# EAGLE design Adafruit NeoPixel Ring 16 rev C (EAGLE 9.6.2)
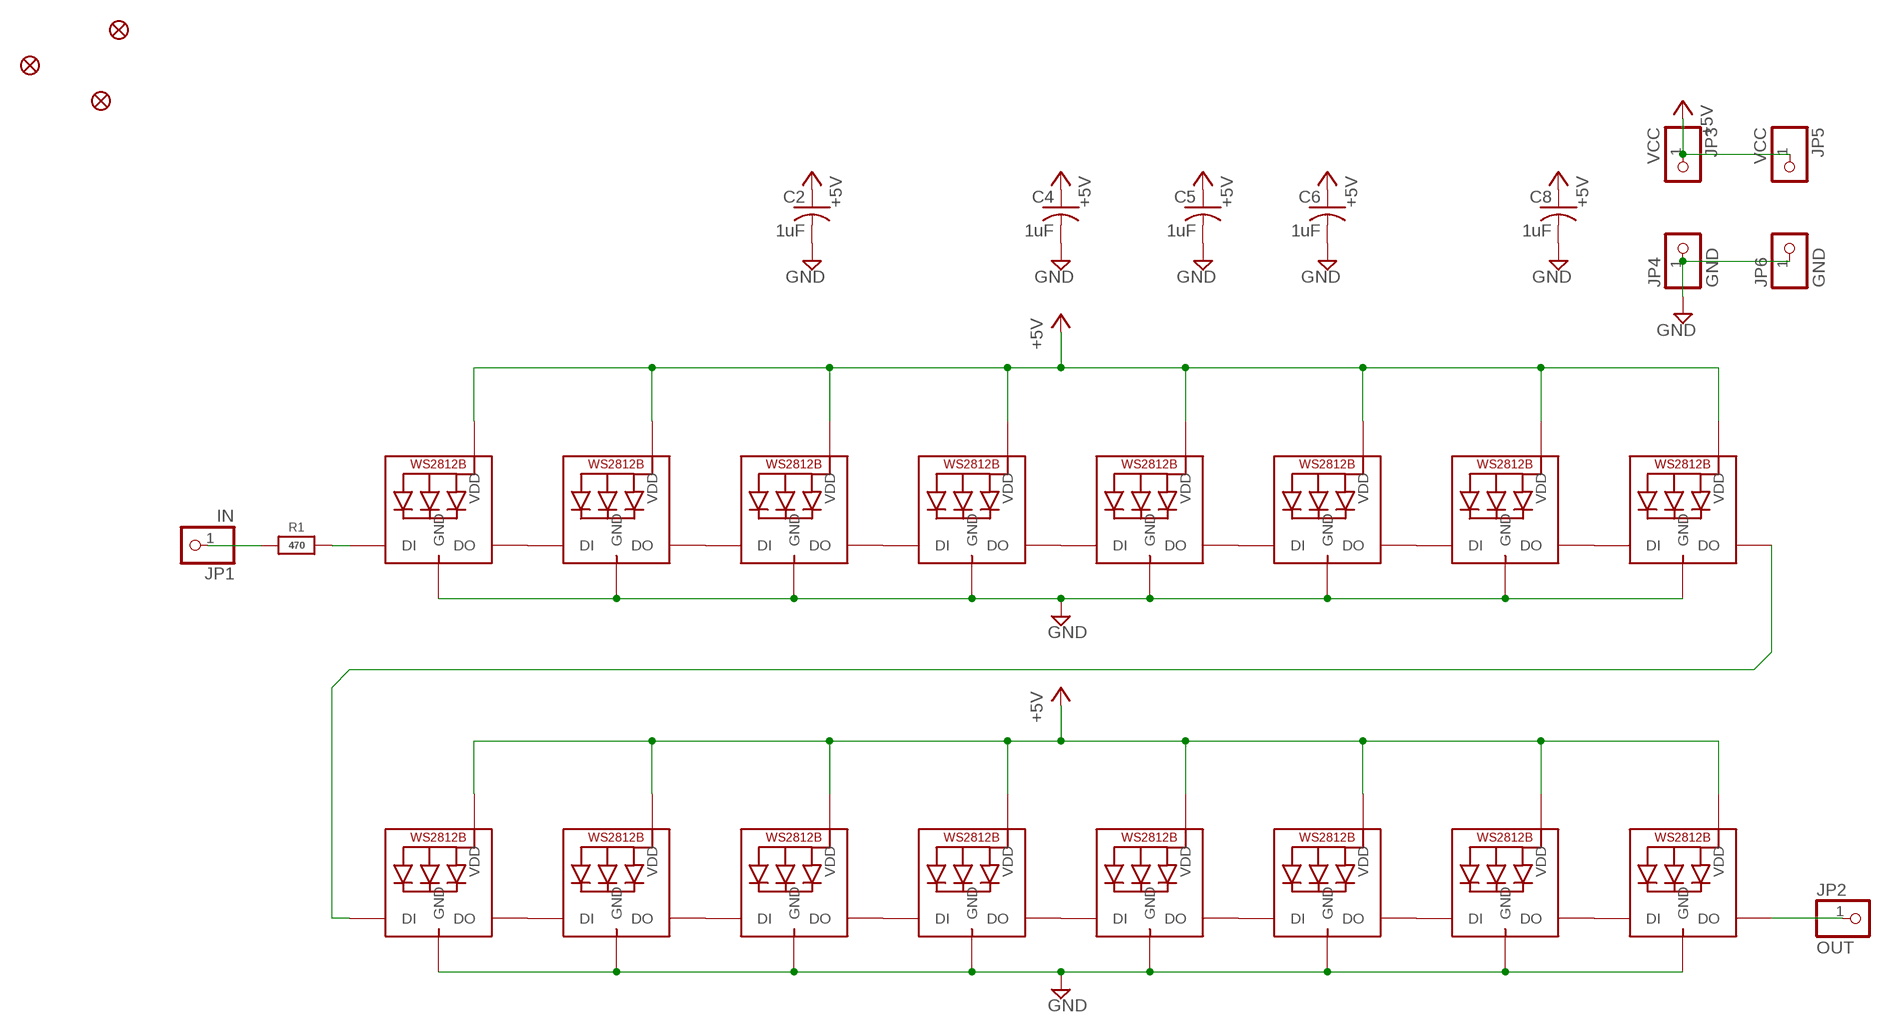
[diagram p0: schematic, sheet 1]

## Parts
C2  1uF  C-USC0603K  [C0603K]
C4  1uF  C-USC0603K  [C0603K]
C5  1uF  C-USC0603K  [C0603K]
C6  1uF  C-USC0603K  [C0603K]
C8  1uF  C-USC0603K  [C0603K]
FID1  FIDUCIAL_1MM  [FIDUCIAL_1MM]
FID2  FIDUCIAL_1MM  [FIDUCIAL_1MM]
FID3  FIDUCIAL_1MM  [FIDUCIAL_1MM]
JP1  IN  PINHD-1X1CB  [1X01-CLEANBIG]
JP2  OUT  PINHD-1X1CB  [1X01-CLEANBIG]
JP3  VCC  PINHD-1X1CB  [1X01-CLEANBIG]
JP4  GND  PINHD-1X1CB  [1X01-CLEANBIG]
JP5  VCC  PINHD-1X1CB  [1X01-CLEANBIG]
JP6  GND  PINHD-1X1CB  [1X01-CLEANBIG]
LED1  WS2812B_5050N  [WS2812B-NARROW]
LED2  WS2812B_5050N  [WS2812B-NARROW]
LED3  WS2812B_5050N  [WS2812B-NARROW]
LED4  WS2812B_5050N  [WS2812B-NARROW]
LED5  WS2812B_5050N  [WS2812B-NARROW]
LED6  WS2812B_5050N  [WS2812B-NARROW]
LED7  WS2812B_5050N  [WS2812B-NARROW]
LED8  WS2812B_5050N  [WS2812B-NARROW]
LED9  WS2812B_5050N  [WS2812B-NARROW]
LED10  WS2812B_5050N  [WS2812B-NARROW]
LED11  WS2812B_5050N  [WS2812B-NARROW]
LED12  WS2812B_5050N  [WS2812B-NARROW]
LED13  WS2812B_5050N  [WS2812B-NARROW]
LED14  WS2812B_5050N  [WS2812B-NARROW]
LED15  WS2812B_5050N  [WS2812B-NARROW]
LED16  WS2812B_5050N  [WS2812B-NARROW]
R1  470  RESISTOR_0603_NOOUT  [0603-NO]

## Nets
+5V: C2.1 C4.1 C5.1 C6.1 C8.1 JP3.1 JP5.1 LED1.1-VDD(VDD) LED2.1-VDD(VDD) LED3.1-VDD(VDD) LED4.1-VDD(VDD) LED5.1-VDD(VDD) LED6.1-VDD(VDD) LED7.1-VDD(VDD) LED8.1-VDD(VDD) LED9.1-VDD(VDD) LED10.1-VDD(VDD) LED11.1-VDD(VDD) LED12.1-VDD(VDD) LED13.1-VDD(VDD) LED14.1-VDD(VDD) LED15.1-VDD(VDD) LED16.1-VDD(VDD)
GND: C2.2 C4.2 C5.2 C6.2 C8.2 JP4.1 JP6.1 LED1.3-GND(GND) LED2.3-GND(GND) LED3.3-GND(GND) LED4.3-GND(GND) LED5.3-GND(GND) LED6.3-GND(GND) LED7.3-GND(GND) LED8.3-GND(GND) LED9.3-GND(GND) LED10.3-GND(GND) LED11.3-GND(GND) LED12.3-GND(GND) LED13.3-GND(GND) LED14.3-GND(GND) LED15.3-GND(GND) LED16.3-GND(GND)
IN: JP1.1 R1.1
N$1: LED1.2-DOUT(DO) LED2.4-DIN(DI)
N$2: LED2.2-DOUT(DO) LED3.4-DIN(DI)
N$3: LED3.2-DOUT(DO) LED4.4-DIN(DI)
N$4: LED4.2-DOUT(DO) LED5.4-DIN(DI)
N$5: LED5.2-DOUT(DO) LED6.4-DIN(DI)
N$6: LED6.2-DOUT(DO) LED7.4-DIN(DI)
N$7: LED7.2-DOUT(DO) LED8.4-DIN(DI)
N$8: LED1.4-DIN(DI) R1.2
N$9: LED9.2-DOUT(DO) LED10.4-DIN(DI)
N$10: LED10.2-DOUT(DO) LED11.4-DIN(DI)
N$11: LED11.2-DOUT(DO) LED12.4-DIN(DI)
N$12: LED12.2-DOUT(DO) LED13.4-DIN(DI)
N$13: LED13.2-DOUT(DO) LED14.4-DIN(DI)
N$14: LED14.2-DOUT(DO) LED15.4-DIN(DI)
N$15: LED15.2-DOUT(DO) LED16.4-DIN(DI)
N$16: LED8.2-DOUT(DO) LED9.4-DIN(DI)
OUT: JP2.1 LED16.2-DOUT(DO)

## Library data of the parts
C2 C4-C6 C8 = rcl:C-US: CAPACITOR, American symbol; SPICEPREFIX: C
FID1-FID3 = microbuilder:FIDUCIAL: Fiducial Alignment Points Various fiducial points for machine vision alignment.; BOM: EXCLUDE
JP1-JP6 = adafruit:PINHD-1X1: Pin header 1x1 for 0.1" spacing With round pins
LED1-LED16 = microbuilder:WS2812B
R1 = microbuilder:RESISTOR: Resistors For new designs, use the packages preceded by an '_' character since they are more reliable: The following footprints should be used on most boards: _0402 - Standard footprint for regular board layouts _0603 - Standard footprint for regular board layouts _0805 - Standard footprint for regular board layouts _1206 - Standard footprint for regular board layouts For extremely tight-pitch boards where space is at a premium, the following 'micro-pitch' footprints can be used (smaller pads, no silkscreen outline, etc.): _0402MP - Micro-pitch footprint for very dense/compact boards _0603MP - Micro-pitch footprint for very dense/compact boards _0805MP - Micro-pitch footprint for very dense/compact boards _1206MP - Micro-pitch footprint for very dense/compact boards

## Board
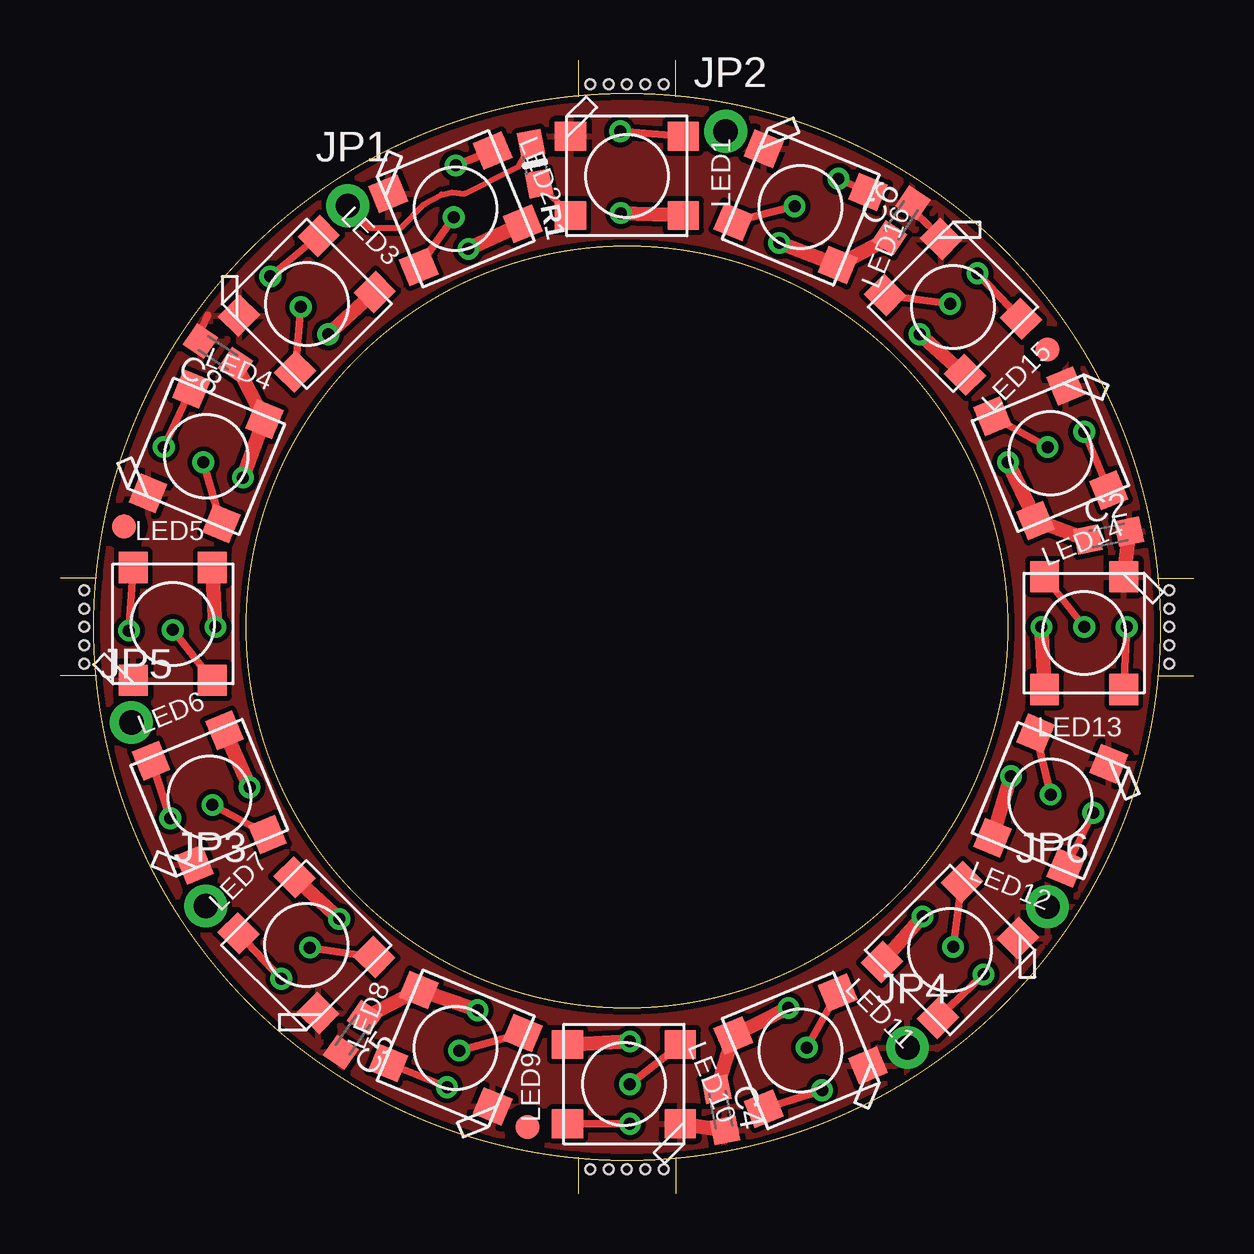
[diagram p1: board, top side]
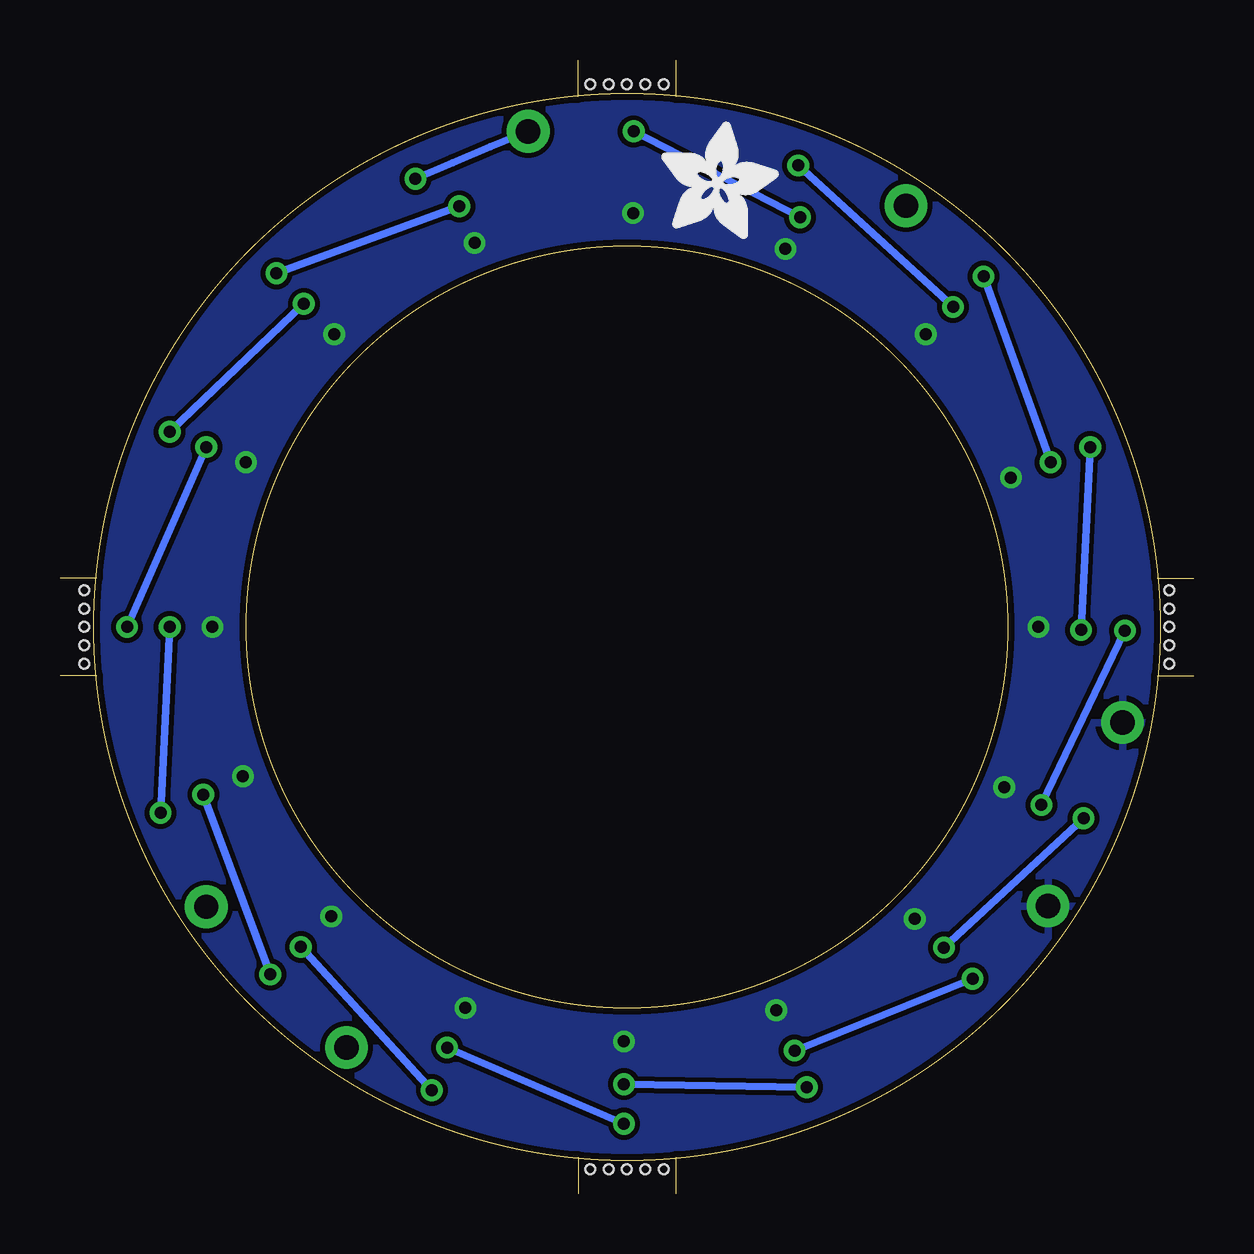
[diagram p2: board, bottom side, seen from below]

Size 47.24 x 47.24 mm. Coordinates in mm from the lower left corner, seen from the top.
Outline: 21.59,1.52 21.59,0
Outline: 25.65,1.52 25.65,0
Outline: 45.72,25.65 47.24,25.65
Outline: 45.72,21.59 47.24,21.59
Outline: 25.65,45.72 25.65,47.24
Outline: 21.59,47.24 21.59,45.72
Outline: 1.52,21.59 0,21.59
Outline: 1.52,25.65 0,25.65
Outline: circle at 23.62,23.62 radius 22.23
Outline: circle at 23.62,23.62 radius 15.88
Copper layers (1*16): Top 0.035mm / dielectric 1.5mm / Bottom 0.035mm
Design rules "adafruit *": minimum track width 8mil, minimum drill 15.5mil, track to track 8mil, track to pad 8mil, pad to pad 8mil, via to via 8mil, smd to smd 8mil, copper to edge 10mil, drill to drill 8mil, minimum pad ring 10mil, minimum via ring 8mil, stop-mask expansion 4mil, vias tented up to drill 20mil, thermal gap 10mil
Holes 0.4 mm at 23.62,46.23 22.86,46.23 22.1,46.23 24.38,46.23 25.15,46.23 1.02,23.62 1.02,24.38 1.02,22.86 1.02,22.1 1.02,25.15 46.23,23.62 46.23,24.38 46.23,25.15 46.23,22.86 46.23,22.1 23.62,1.02 22.86,1.02 22.1,1.02 24.38,1.02 25.15,1.02

### Footprints (pad centres in the part's own frame; a part is rotated, then mirrored left to right if it is on the bottom)
C0603K = smd 1.05 x 1.08: 1 -0.875,0; 2 0.875,0
FIDUCIAL_1MM = smd 1 x 1: 1 0,0
1X01-CLEANBIG = drill 1.016 pad 1.778: 1 0,0
WS2812B-NARROW = smd 1.3 x 1.2: 1-VDD 2.35,-1.65; 2-DOUT 2.35,1.65; 3-GND -2.35,1.65; 4-DIN -2.35,-1.65
0603-NO = smd 1.075 x 1: 1 -0.85,0; 2 0.85,0

### Placement (x,y rotation side)
C2  43.69,27.43 11.3 top
C4  27.53,3.51 281.3 top
C5  12.2,6.62 235.3 top
C6  35.05,40.57 56.3 top
C8  6.59,35.05 146.3 top
FID1  41.15,35.18 0 top
FID2  19.48,2.79 0 top
FID3  2.67,27.81 0 top
JP1  11.99,41.17 0 top
JP2  27.74,44.27 0 top
JP3  6.07,11.99 0 top
JP4  35.31,6.1 0 top
JP5  2.97,19.63 0 top
JP6  41.15,11.96 0 top
LED1  23.62,42.42 0 top
LED2  16.48,41.05 22.5 top
LED3  10.29,37.08 45 top
LED4  6.1,30.73 67.5 top
LED5  4.7,23.75 90 top
LED6  6.22,16.51 112.5 top
LED7  10.26,10.36 135 top
LED8  16.48,6.07 157.5 top
LED9  23.5,4.57 180 top
LED10  30.86,5.97 202.5 top
LED11  37.08,10.16 225 top
LED12  41.27,16.38 247.5 top
LED13  42.67,23.37 270 top
LED14  41.27,30.86 292.5 top
LED15  37.21,36.96 315 top
LED16  30.86,41.12 337.5 top
PLABEL0  [PLABEL0]  13.77,39.42 123.8 top
PLABEL1  [PLABEL1]  27.48,41.4 78.7 top
PLABEL2  [PLABEL2]  7.26,12.23 33.7 top
PLABEL3  [PLABEL3]  34.92,7.24 123.8 top
PLABEL4  [PLABEL4]  40.44,12.75 123.8 top
PLABEL5  [PLABEL5]  4.54,19.26 33.7 top
PLABEL6  [PLABEL6]  8.33,10.62 60 bottom
PLABEL7  [PLABEL7]  10.01,11.81 60 bottom
PLABEL8  [PLABEL8]  40.08,10.72 330 bottom
PLABEL9  [PLABEL9]  39.14,14.1 330 bottom
PLABEL10  [PLABEL10]  13.51,38.84 330 bottom
PLABEL11  [PLABEL11]  26.9,41.66 20 bottom
PLABEL12  [PLABEL12]  14.2,9.25 0 bottom
PLABEL13  [PLABEL13]  16.54,7.11 0 bottom
PLABEL14  [PLABEL14]  39.01,34.8 0 bottom
PLABEL15  [PLABEL15]  36.09,37.97 0 bottom
R1  19.79,42.93 281.3 top
U$2  [ADAFRUIT_5MM]  22.17,39.8 0 bottom

### Tracks (layer width: path | path; a pad name or v marks a point on that pad's centre or on a via)
+5V  (via drill 0.5)
  Top 0.61: v6.48,23.62 LED5.1-VDD | v7.62,29.84 LED4.1-VDD C8.1 | v11.18,35.81 LED3.1-VDD | v17.02,39.37 LED2.1-VDD | v23.37,40.87 LED1.1-VDD | v29.97,39.62 LED16.1-VDD C6.1 | LED15.1-VDD v35.81,35.81 | v39.5,30.48 LED14.1-VDD C2.1 | v40.89,23.62 LED13.1-VDD | LED12.1-VDD v39.62,17.4 | v35.94,11.56 LED11.1-VDD | v30.35,7.75 LED10.1-VDD C4.1 | LED9.1-VDD v23.75,6.35 | C5.1 LED8.1-VDD v17.4,7.64 | v11.63,11.46 LED7.1-VDD | v7.9,16.94 LED6.1-VDD
  pour Bottom: 46.48,23.62 arc90 23.62,46.48 arc90 0.76,23.62 arc90 23.62,0.76 arc90
GND
  Top 0.305: 5.84,35.92 6.15,36.6 | 35.66,40.87 36.17,40.36
  Top 0.61: C2.2 LED13.3-GND | C4.2 LED9.3-GND
  pour Top: 46.48,23.62 arc90 23.62,46.48 arc90 0.76,23.62 arc90 23.62,0.76 arc90
IN
  Top 0.254: JP1.1 11.99,41.15 12.88,40.26 14.2,40.26 15.16,41.22 15.9,41.63 16.33,41.73 16.87,41.68 19.1,42.8 R1.1
N$1  (via drill 0.5)
  Top 0.305: LED2.4-DIN v16.41,40.69 | v23.34,44.27 LED1.2-DOUT
  Bottom 0.305: v16.41,40.69 v23.34,44.27
N$2  (via drill 0.5)
  Top 0.305: LED3.4-DIN v10.03,36.96 | v16.48,42.85 LED2.2-DOUT
  Bottom 0.305: v10.03,36.96 v16.48,42.85
N$3  (via drill 0.5)
  Top 0.305: LED4.4-DIN v5.97,30.48 | v8.76,38.23 LED3.2-DOUT
  Bottom 0.305: v5.97,30.48 v8.76,38.23
N$4  (via drill 0.5)
  Top 0.305: v4.7,23.5 LED5.4-DIN | v4.32,31.12 LED4.2-DOUT
  Bottom 0.305: v4.7,23.5 v4.32,31.12
N$5  (via drill 0.5)
  Top 0.305: LED6.4-DIN v6.35,16.2 | v2.87,23.47 LED5.2-DOUT
  Bottom 0.305: v6.35,16.2 v2.87,23.47
N$6  (via drill 0.5)
  Top 0.305: v10.41,10.26 LED7.4-DIN | v4.6,15.65 LED6.2-DOUT
  Bottom 0.305: v10.41,10.26 v4.6,15.65
N$7  (via drill 0.5)
  Top 0.305: LED8.4-DIN v16.64,5.97 | v9.22,8.97 LED7.2-DOUT
  Bottom 0.305: v16.64,5.97 v9.22,8.97
N$8
  Top 0.254: R1.2 LED1.4-DIN
N$9  (via drill 0.5)
  Top 0.305: LED10.4-DIN v31.12,6.1 | LED9.2-DOUT v23.75,2.92
  Bottom 0.305: v31.12,6.1 v23.75,2.92
N$10  (via drill 0.5)
  Top 0.305: LED11.4-DIN v37.21,10.29 | v31.75,4.32 LED10.2-DOUT
  Bottom 0.305: v31.75,4.32 v37.21,10.29
N$11  (via drill 0.5)
  Top 0.305: LED12.4-DIN v41.27,16.64 | LED11.2-DOUT v38.48,9.14
  Bottom 0.305: v41.27,16.64 v38.48,9.14
N$12  (via drill 0.5)
  Top 0.305: LED13.4-DIN v42.67,23.62 | v43.05,15.88 LED12.2-DOUT
  Bottom 0.305: v42.67,23.62 v43.05,15.88
N$13  (via drill 0.5)
  Top 0.305: LED14.4-DIN v41.15,31.12 | LED13.2-DOUT v44.45,23.62
  Bottom 0.305: v41.15,31.12 v44.45,23.62
N$14  (via drill 0.5)
  Top 0.305: LED15.4-DIN v37.08,37.08 | v42.67,31.75 LED14.2-DOUT
  Bottom 0.305: v37.08,37.08 v42.67,31.75
N$15  (via drill 0.5)
  Top 0.305: LED16.4-DIN v30.61,41.15 | v38.23,38.35 LED15.2-DOUT
  Bottom 0.305: v30.61,41.15 v38.23,38.35
N$16  (via drill 0.5)
  Top 0.305: LED9.4-DIN v23.75,4.57 | LED8.2-DOUT v16.13,4.45
  Bottom 0.305: v23.75,4.57 v16.13,4.45
OUT  (via drill 0.5)
  Top 0.305: LED16.2-DOUT v32.44,42.29
  Bottom 0.305: v32.44,42.29 arc2 JP2.1

### Text on the board
Pinguin_tBackup: out | IN | V+ | V+ | G | G
Pinguin_bBackup: Data / Out | Data / Input | NeoPixel | Ring 16 | Power | 5V DC | Power & / Signal | 16 x | Ground | SKC6812